# Altium schematic sheet V831_CORE.SchDoc
size A4; SheetNumber: 2; SheetTotal: 2
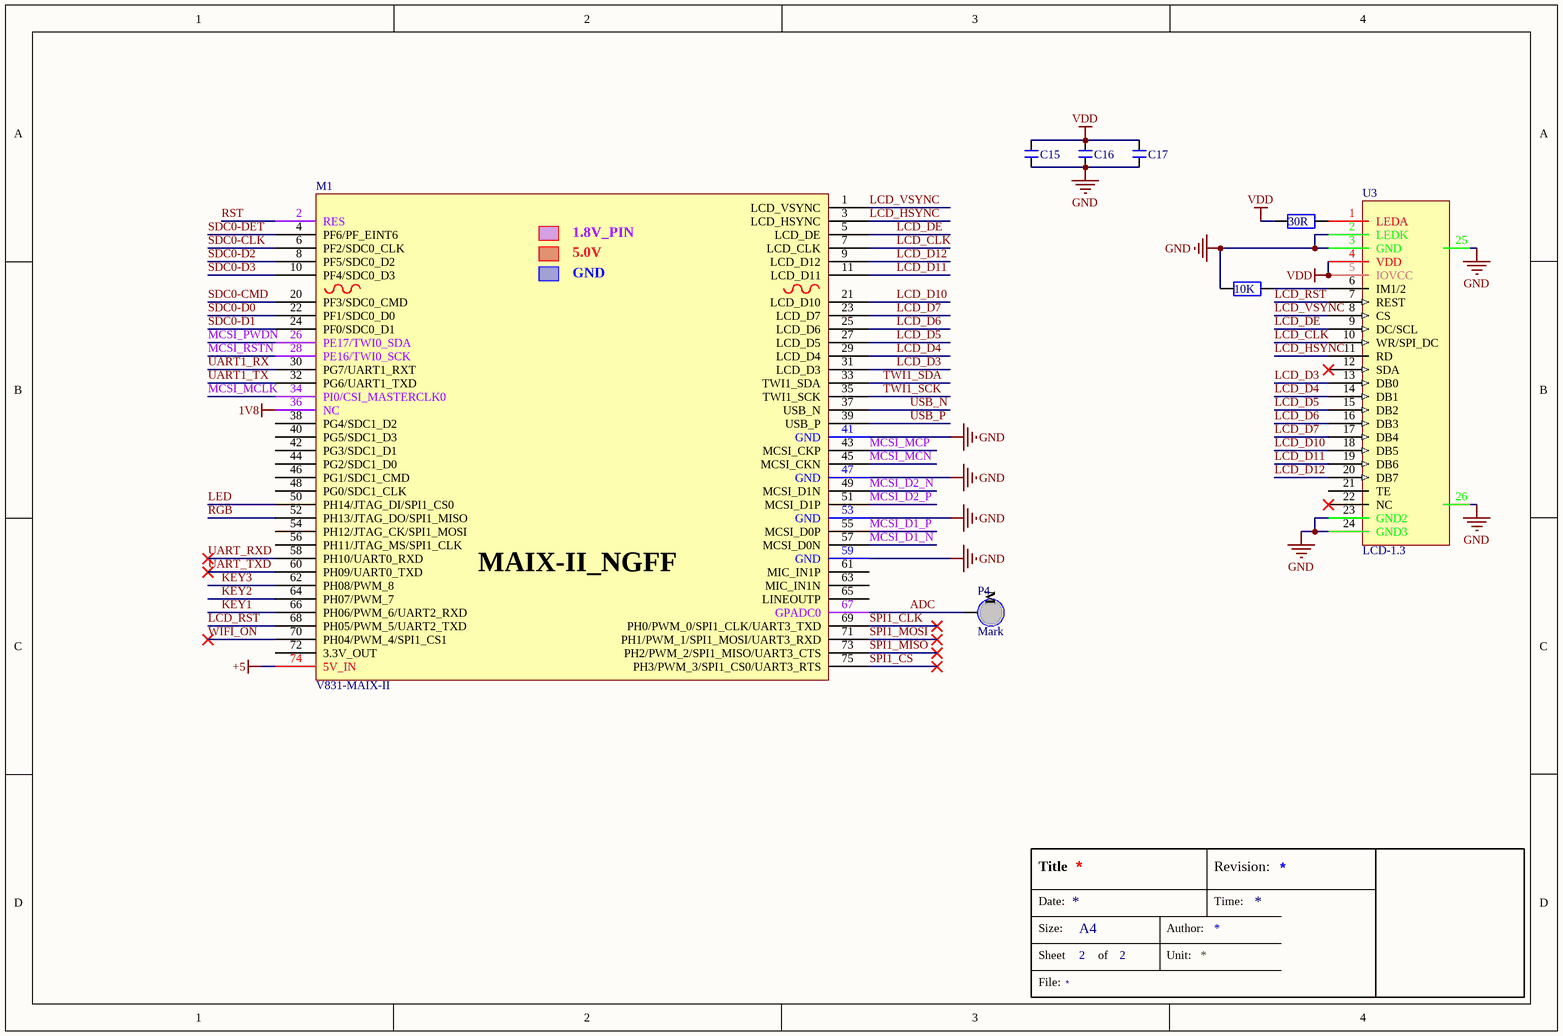
[diagram p0: V831_CORE.SchDoc]

## Parts
C15  100NF  [CAP_0603]  (value not drawn)
C16  100NF  [CAP_0603]  (value not drawn)
C17  100NF  [CAP_0603]  (value not drawn)
M1  V831-MAIX-II  [V831_NAIX-II]
P4  Mark  [Mark]
R15  30R  [RESC_0603_2]
R16  10K  [RESC_0603_2]
U3  LCD-1.3  [FPC-24PIN-FB-Mirror]

## Nets
1V8: M1.36(NC)
+5: M1.74(5V_IN)
GND: C15.1 C16.1 C17.1 M1.41(GND) M1.47(GND) M1.53(GND) M1.59(GND) R16.2 U3.2(LEDK) U3.3(GND) U3.23(GND2) U3.24(GND3) U3.25(GND) U3.26(GND)
VDD: C15.2 C16.2 C17.2 R15.2 U3.4(VDD) U3.5(IOVCC)
ADC: M1.67(GPADC0) P4.1
KEY1: M1.66(PH06/PWM_6/UART2_RXD)
KEY2: M1.64(PH07/PWM_7)
KEY3: M1.62(PH08/PWM_8)
LCD_CLK: M1.7(LCD_CLK) U3.10(WR/SPI_DC)
LCD_D3: M1.31(LCD_D3) U3.13(DB0)
LCD_D4: M1.29(LCD_D4) U3.14(DB1)
LCD_D5: M1.27(LCD_D5) U3.15(DB2)
LCD_D6: M1.25(LCD_D6) U3.16(DB3)
LCD_D7: M1.23(LCD_D7) U3.17(DB4)
LCD_D10: M1.21(LCD_D10) U3.18(DB5)
LCD_D11: M1.11(LCD_D11) U3.19(DB6)
LCD_D12: M1.9(LCD_D12) U3.20(DB7)
LCD_DE: M1.5(LCD_DE) U3.9(DC/SCL)
LCD_HSYNC: M1.3(LCD_HSYNC) U3.11(RD)
LCD_RST: M1.68(PH05/PWM_5/UART2_TXD) U3.7(REST)
LCD_VSYNC: M1.1(LCD_VSYNC) U3.8(CS)
LED: M1.50(PH14/JTAG_DI/SPI1_CS0)
MCSI_D1_N: M1.57(MCSI_D0N)
MCSI_D1_P: M1.55(MCSI_D0P)
MCSI_D2_N: M1.49(MCSI_D1N)
MCSI_D2_P: M1.51(MCSI_D1P)
MCSI_MCLK: M1.34(PI0/CSI_MASTERCLK0)
MCSI_MCN: M1.45(MCSI_CKN)
MCSI_MCP: M1.43(MCSI_CKP)
MCSI_PWDN: M1.26(PE17/TWI0_SDA)
MCSI_RSTN: M1.28(PE16/TWI0_SCK)
RGB: M1.52(PH13/JTAG_DO/SPI1_MISO)
RST: M1.2(RES)
SDC0-CLK: M1.6(PF2/SDC0_CLK)
SDC0-CMD: M1.20(PF3/SDC0_CMD)
SDC0-D0: M1.22(PF1/SDC0_D0)
SDC0-D1: M1.24(PF0/SDC0_D1)
SDC0-D2: M1.8(PF5/SDC0_D2)
SDC0-D3: M1.10(PF4/SDC0_D3)
SDC0-DET: M1.4(PF6/PF_EINT6)
SPI1_CLK: M1.69(PH0/PWM_0/SPI1_CLK/UART3_TXD)
SPI1_CS: M1.75(PH3/PWM_3/SPI1_CS0/UART3_RTS)
SPI1_MISO: M1.73(PH2/PWM_2/SPI1_MISO/UART3_CTS)
SPI1_MOSI: M1.71(PH1/PWM_1/SPI1_MOSI/UART3_RXD)
TWI1_SCK: M1.35(TWI1_SCK)
TWI1_SDA: M1.33(TWI1_SDA)
UART1_RX: M1.30(PG7/UART1_RXT)
UART1_TX: M1.32(PG6/UART1_TXD)
UART_RXD: M1.58(PH10/UART0_RXD)
UART_TXD: M1.60(PH09/UART0_TXD)
USB_N: M1.37(USB_N)
USB_P: M1.39(USB_P)
WIFI_ON: M1.70(PH04/PWM_4/SPI1_CS1)
NetR15_1: R15.1 U3.1(LEDA)
NetR16_1: R16.1 U3.6(IM1/2)

Not connected (* = marked no-connect by the designer): M1 38(PG4/SDC1_D2) 40(PG5/SDC1_D3) 42(PG3/SDC1_D1) 44(PG2/SDC1_D0) 46(PG1/SDC1_CMD) 48(PG0/SDC1_CLK) 54(PH12/JTAG_CK/SPI1_MOSI) 56(PH11/JTAG_MS/SPI1_CLK) 61(MIC_IN1P) 63(MIC_IN1N) 65(LINEOUTP) 72(3.3V_OUT); U3 12(SDA)* 21(TE) 22(NC)*

## Notes on the sheet
- Title
- Date:
- Revision:
- Time:
- File:
- Size:
- Sheet
- A4
- of
- Author:
- Unit:
- (in symbol Mark) M
- (in symbol V831_MAIX-II) 1.8V_PIN; 5.0V; MAIX-II_NGFF

## Library data of the parts
C15-C17 = CAP: CAP  12~50V
M1 = V831_MAIX-II: Sipeed-v831-M2dock
R15 R16 = RES: RES 贴片
U3 = LCD_1.3: SHOW  24Pin